# Altium schematic sheet VGA.SchDoc
size A
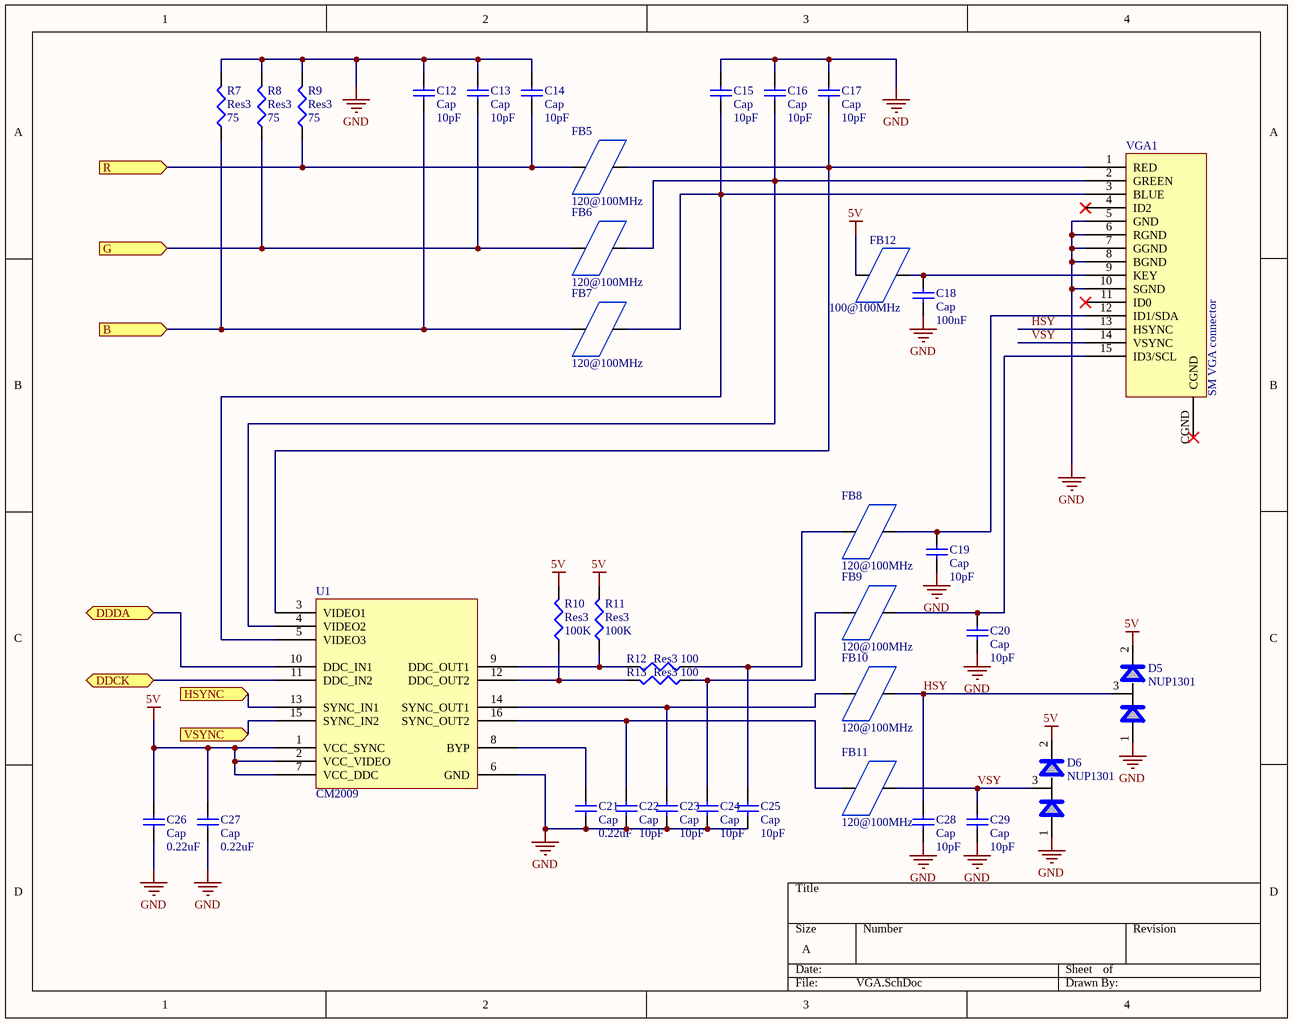
[diagram p0: VGA.SchDoc]

## Parts
C12  Cap  value 10pF  [0603]
C13  Cap  value 10pF  [0603]
C14  Cap  value 10pF  [0603]
C15  Cap  value 10pF  [0603]
C16  Cap  value 10pF  [0603]
C17  Cap  value 10pF  [0603]
C18  Cap  value 100nF  [0603]
C19  Cap  value 10pF  [0603]
C20  Cap  value 10pF  [0603]
C21  Cap  value 0.22uF  [0603]
C22  Cap  value 10pF  [0603]
C23  Cap  value 10pF  [0603]
C24  Cap  value 10pF  [0603]
C25  Cap  value 10pF  [0603]
C26  Cap  value 0.22uF  [0603]
C27  Cap  value 0.22uF  [0603]
C28  Cap  value 10pF  [0603]
C29  Cap  value 10pF  [0603]
D5  NUP1301  [SOT23]
D6  NUP1301  [SOT23]
FB5  120@100MHz  [INDC1608X09N]
FB6  120@100MHz  [INDC1608X09N]
FB7  120@100MHz  [INDC1608X09N]
FB8  120@100MHz  [INDC1608X09N]
FB9  120@100MHz  [INDC1608X09N]
FB10  120@100MHz  [INDC1608X09N]
FB11  120@100MHz  [INDC1608X09N]
FB12  100@100MHz  [INDC1608X09N]
R7  Res3  value 75  [J1-0603]
R8  Res3  value 75  [J1-0603]
R9  Res3  value 75  [J1-0603]
R10  Res3  value 100K  [J1-0603]
R11  Res3  value 100K  [J1-0603]
R12  Res3  value 100  [J1-0603]
R13  Res3  value 100  [J1-0603]
U1  CM2009  [SOP64P630X173-16N]
VGA1  SM VGA connector  [15POS SM 30MIL-PITCH]

## Ports
B (in), DDCK (bidir), DDDA (bidir), G (in), HSYNC (in), R (in), VSYNC (in)

## Nets
5V: C26.2 C27.2 D5.2 D6.2 FB12.1 R10.2 R11.2 U1.1(VCC_SYNC) U1.2(VCC_VIDEO) U1.7(VCC_DDC)
GND: C12.2 C13.2 C14.2 C15.2 C16.2 C17.2 C18.1 C19.1 C20.1 C21.1 C22.1 C23.1 C24.1 C25.1 C26.1 C27.1 C28.1 C29.1 D5.1 D6.1 R7.2 R8.2 R9.2 U1.6(GND) VGA1.5(GND) VGA1.6(RGND) VGA1.7(GGND) VGA1.8(BGND) VGA1.10(SGND)
B: C12.1 FB7.1 R7.1 ; port B
DDCK: U1.11(DDC_IN2) ; port DDCK
DDDA: U1.10(DDC_IN1) ; port DDDA
G: C13.1 FB6.1 R8.1 ; port G
HSY: C28.2 D5.3 FB10.2 VGA1.13(HSYNC)
HSYNC: U1.13(SYNC_IN1) ; port HSYNC
R: C14.1 FB5.1 R9.1 ; port R
VSY: C29.2 D6.3 FB11.2 VGA1.14(VSYNC)
VSYNC: U1.15(SYNC_IN2) ; port VSYNC
NetC15_1: C15.1 FB7.2 U1.5(VIDEO3) VGA1.3(BLUE)
NetC16_1: C16.1 FB6.2 U1.4(VIDEO2) VGA1.2(GREEN)
NetC17_1: C17.1 FB5.2 U1.3(VIDEO1) VGA1.1(RED)
NetC18_2: C18.2 FB12.2 VGA1.9(KEY)
NetC19_2: C19.2 FB8.2 VGA1.12(ID1/SDA)
NetC20_2: C20.2 FB9.2 VGA1.15(ID3/SCL)
NetC21_2: C21.2 U1.8(BYP)
NetC22_2: C22.2 FB11.1 U1.16(SYNC_OUT2)
NetC23_2: C23.2 FB10.1 U1.14(SYNC_OUT1)
NetC24_2: C24.2 FB9.1 R13.1
NetC25_2: C25.2 FB8.1 R12.1
NetR10_1: R10.1 R13.2 U1.12(DDC_OUT2)
NetR11_1: R11.1 R12.2 U1.9(DDC_OUT1)

Not connected (* = marked no-connect by the designer): VGA1 4(ID2)* 11(ID0)* CGND*

## Library data of the parts
C12-C29 = Cap: Capacitor; Published: 8-Jun-2000; LatestRevisionDate: 17-Jul-2002; LatestRevisionNote: Re-released for DXP Platform.; PackageReference: RAD-0.3; Publisher: Altium Limited; Supplier: DigiKey
  C12-C17 C19 C20 C22-C25 C28 C29: Supplier Part #: PCC100CVCT-ND
  C18: Supplier Part #: 587-1245-1-ND
  C21 C26 C27: Supplier Part #: 587-1260-1-ND
D5 D6 = NUP1301: Low Capacitance Diode Array for ESD Protection; Model: NUP1301ML3T1; Supplier Part #: NUP1301ML3T1GOSCT-ND; Supplier: DigiKey
FB5-FB12 = Ferrite Bead: Supplier: DigiKey
  FB5-FB11: Supplier Part #: 445-2190-1-ND
  FB12: Supplier Part #: 587-1922-1-ND
R7-R13 = Res3: Resistor; Published: 8-Jun-2000; LatestRevisionDate: 04-Mar-2005; LatestRevisionNote: PCB Footprint replaced.; PackageReference: J1-0603; Publisher: Altium Limited; Supplier: DigiKey
  R7-R9: Supplier Part #: P75GCT-ND
  R10 R11: Supplier Part #: P100KGCT-ND
  R12 R13: Supplier Part #: P100GCT-ND
U1 = CM2009: VGA ESD Protection; Model: CM2009; Supplier Part #: 748-CM2009-00QR; Supplier: Mouser
VGA1 = VGA: Supplier Part #: 200-15FA-ND; Supplier: DigiKey